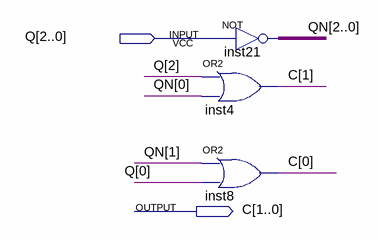
[diagram p0: schematic sheet]
// Quartus schematic C.bdf as structural Verilog: 3 symbols, 2 pins
module C (
  input  [2:0] Q,
  output [1:0] C
);

  wire [2:0] QN;

  assign QN = ~Q;  // NOT inst21, 3 bits wide
  or inst4 (C[1], Q[2], QN[0]);
  or inst8 (C[0], QN[1], Q[0]);
endmodule
